# EAGLE schematic BSPDTesting (EAGLE 7.6.0)
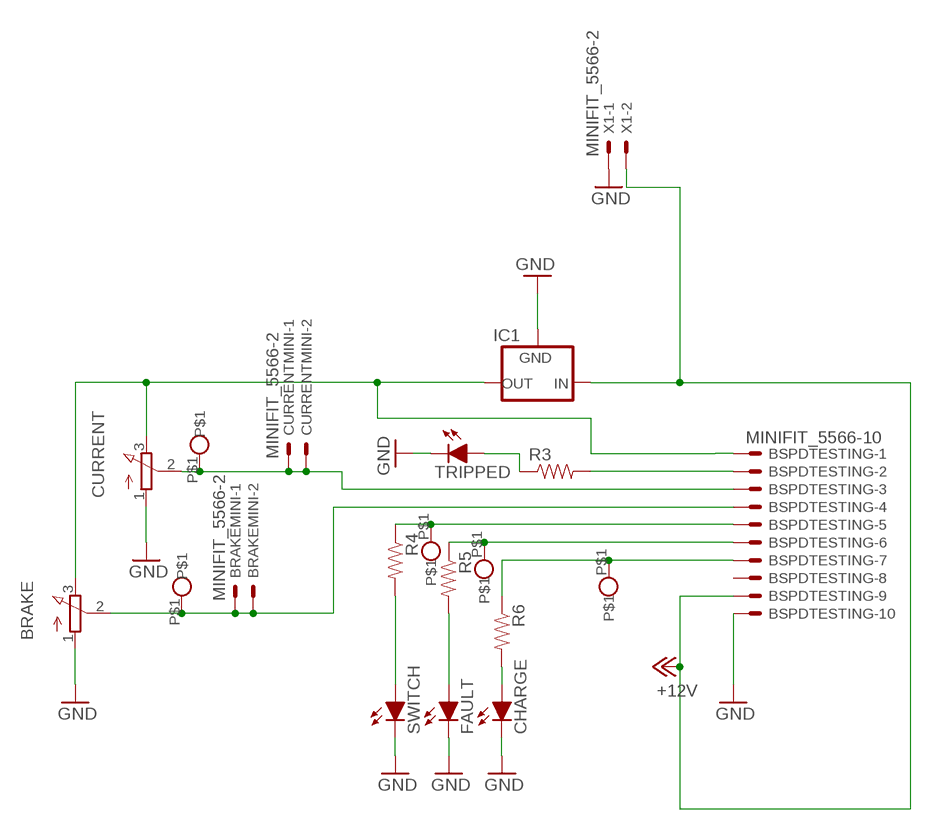
[diagram p0: schematic, sheet 1]

## Parts
BRAKE  3RP/1610N  [3RP/1610N]
BRAKEMINI  MINIFIT_5566-2  [MINIFIT_5566-2]
BSPDTESTING  MINIFIT_5566-10  [MINIFIT_5566-10]
CHARGE  LED-3MM  [LED-3MM]
CURRENT  3RP/1610N  [3RP/1610N]
CURRENTMINI  MINIFIT_5566-2  [MINIFIT_5566-2]
FAULT  LED-3MM  [LED-3MM]
IC1  5VREG_L7805_HOR  [TO-220-H]
R3  RESISTORAXIAL-0.3  [AXIAL-0.3]
R4  RESISTORAXIAL-0.3  [AXIAL-0.3]
R5  RESISTORAXIAL-0.3  [AXIAL-0.3]
R6  RESISTORAXIAL-0.3  [AXIAL-0.3]
SWITCH  LED-3MM  [LED-3MM]
TRIPPED  LED-3MM  [LED-3MM]
U$1  TEST_POINT_COMPACT_THM  [TEST_POINT_COMPACT_THM]
U$2  TEST_POINT_COMPACT_THM  [TEST_POINT_COMPACT_THM]
U$3  TEST_POINT_COMPACT_THM  [TEST_POINT_COMPACT_THM]
U$4  TEST_POINT_COMPACT_THM  [TEST_POINT_COMPACT_THM]
U$5  TEST_POINT_COMPACT_THM  [TEST_POINT_COMPACT_THM]
X1  MINIFIT_5566-2  [MINIFIT_5566-2]

## Nets
+12V: BSPDTESTING.9 IC1.1(IN) X1.2
GND: BRAKE.1(A) BSPDTESTING.10 CHARGE.K(C) CURRENT.1(A) FAULT.K(C) IC1.2(GND) SWITCH.K(C) TRIPPED.K(C) X1.1
N$1: BSPDTESTING.1
N$2: BSPDTESTING.5 R4.P$1 U$3.P$1
N$3: R4.P$2 SWITCH.A
N$4: BSPDTESTING.6 R5.P$1 U$4.P$1
N$5: FAULT.A R5.P$2
N$6: BSPDTESTING.7 R6.P$1 U$5.P$1
N$7: CHARGE.A R6.P$2
N$8: BSPDTESTING.2 R3.P$2
N$9: R3.P$1 TRIPPED.A
N$11: BRAKE.2(S) BRAKEMINI.1 BRAKEMINI.2 BSPDTESTING.4 U$1.P$1
N$12: BSPDTESTING.3 CURRENT.2(S) CURRENTMINI.1 CURRENTMINI.2 U$2.P$1
N$15: BRAKE.3(E) CURRENT.3(E) IC1.3(OUT)
Unconnected: BSPDTESTING.8

## Library data of the parts
BRAKE CURRENT = HyTechDevices:3RP/1610N: 16mm Potentiometer one level Source: http://www.alphapotentiometers.net/html/16mm_pot_2.html
BRAKEMINI CURRENTMINI X1 = HyTechDevices:MINIFIT_5566-2: Mini-Fit Junior connector 2 pole Source: http://www.molex.com; OC_FARNELL: 1822072; OC_NEWARK: unknown
BSPDTESTING = HyTechDevices:MINIFIT_5566-10: Mini-Fit Junior connector 10 pole Source: http://www.molex.com; OC_FARNELL: unknown; OC_NEWARK: unknown
CHARGE FAULT SWITCH TRIPPED = HyTechDevices:LED: Light Emitting Diode (LED) Source: Dangerous Prototypes Eagle Library <https://github.com/DangerousPrototypes/Eagle_Part_Library>
IC1 = HyTechDevices:5VREG_L7805: Voltage Regulator Switching 5v regulator Datasheet <http://power.murata.com/data/power/oki-78sr.pdf> Standard 7805 5V regulator. IGO (Input Ground Output). Spark Fun Electronics SKU : COM-00107 Datasheet <http://www.mouser.com/ds/2/308/MC7800-D-94905.pdf>
R3-R6 = HyTechDevices:RESISTOR: Resistor Basic schematic elements and footprints for 0603, 1206, and PTH resistors.
U$1-U$5 = HyTechDevices:TEST_POINT_COMPACT_THM